# Altium schematic sheet 04_ EFR32 Signal Assign.SchDoc
size 420 x 297 mm
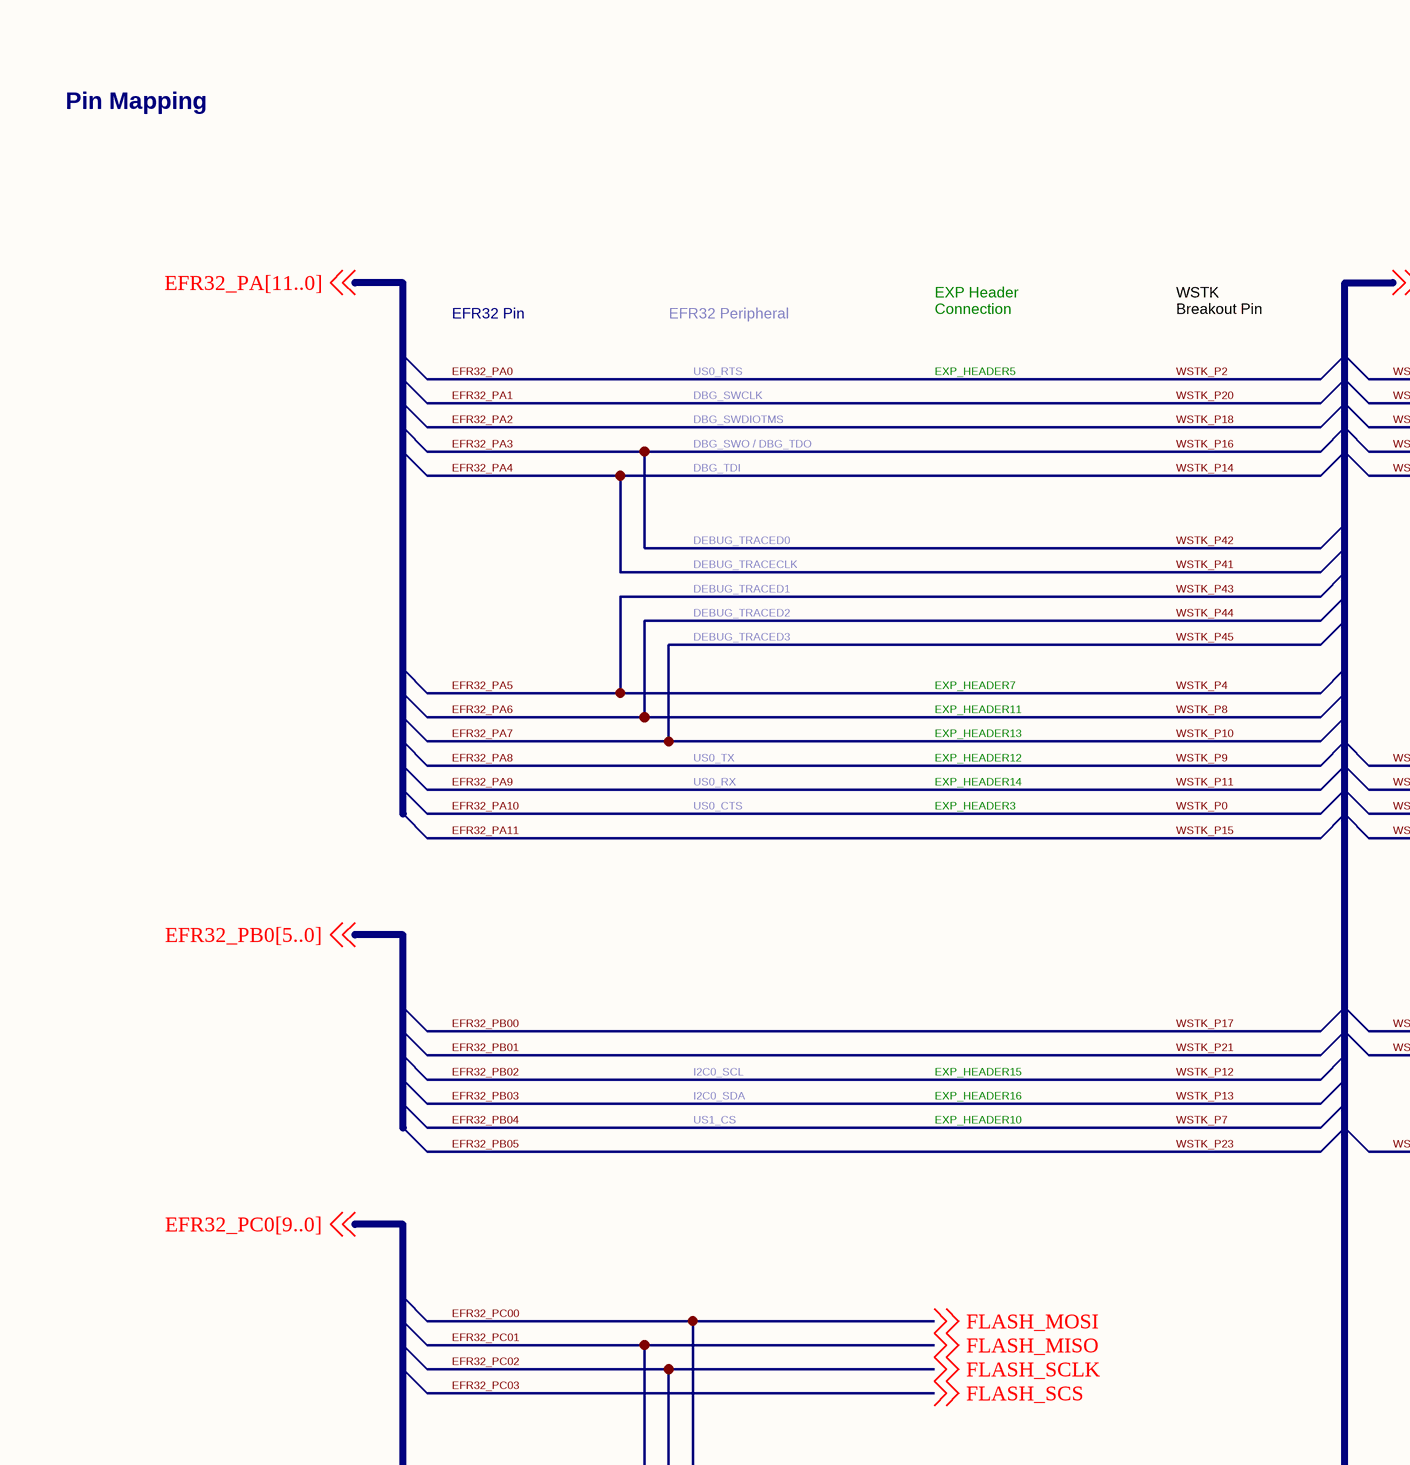
[diagram p0: 04_ EFR32 Signal Assign.SchDoc, top left]
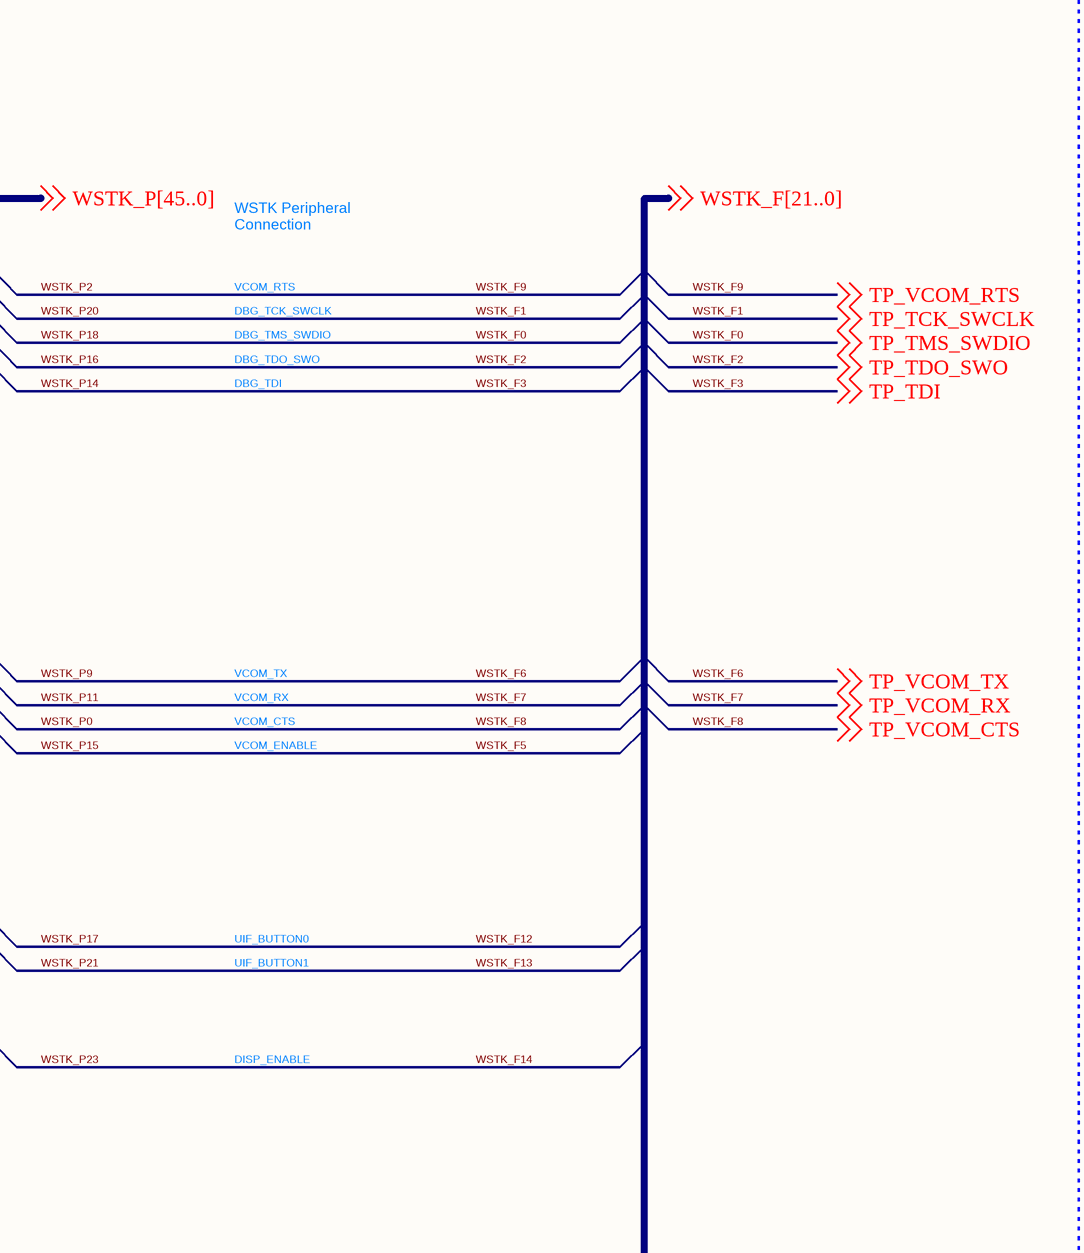
[diagram p1: 04_ EFR32 Signal Assign.SchDoc, top middle]
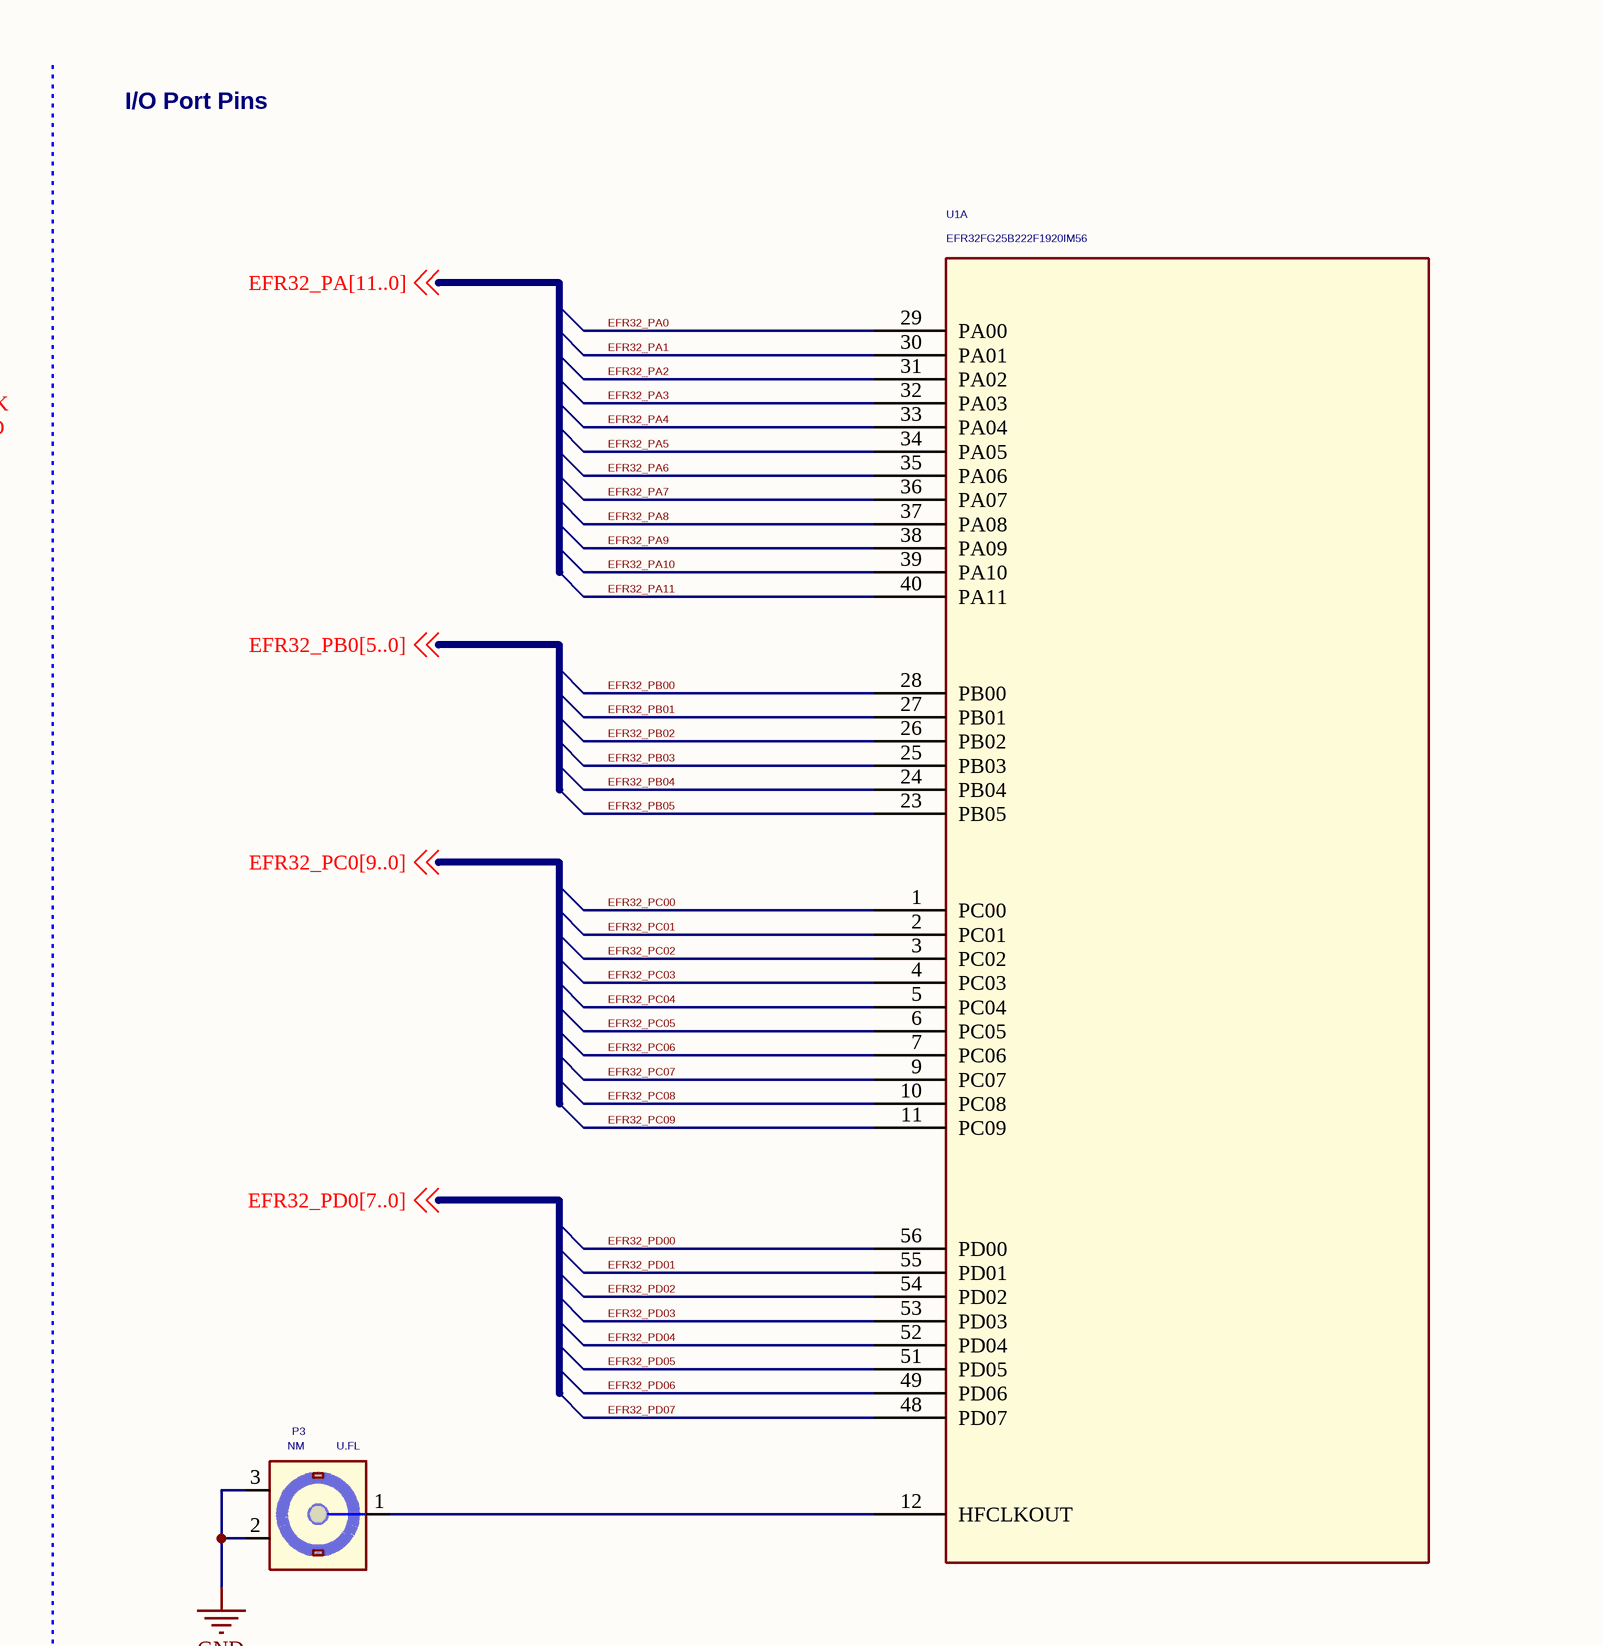
[diagram p2: 04_ EFR32 Signal Assign.SchDoc, top right]
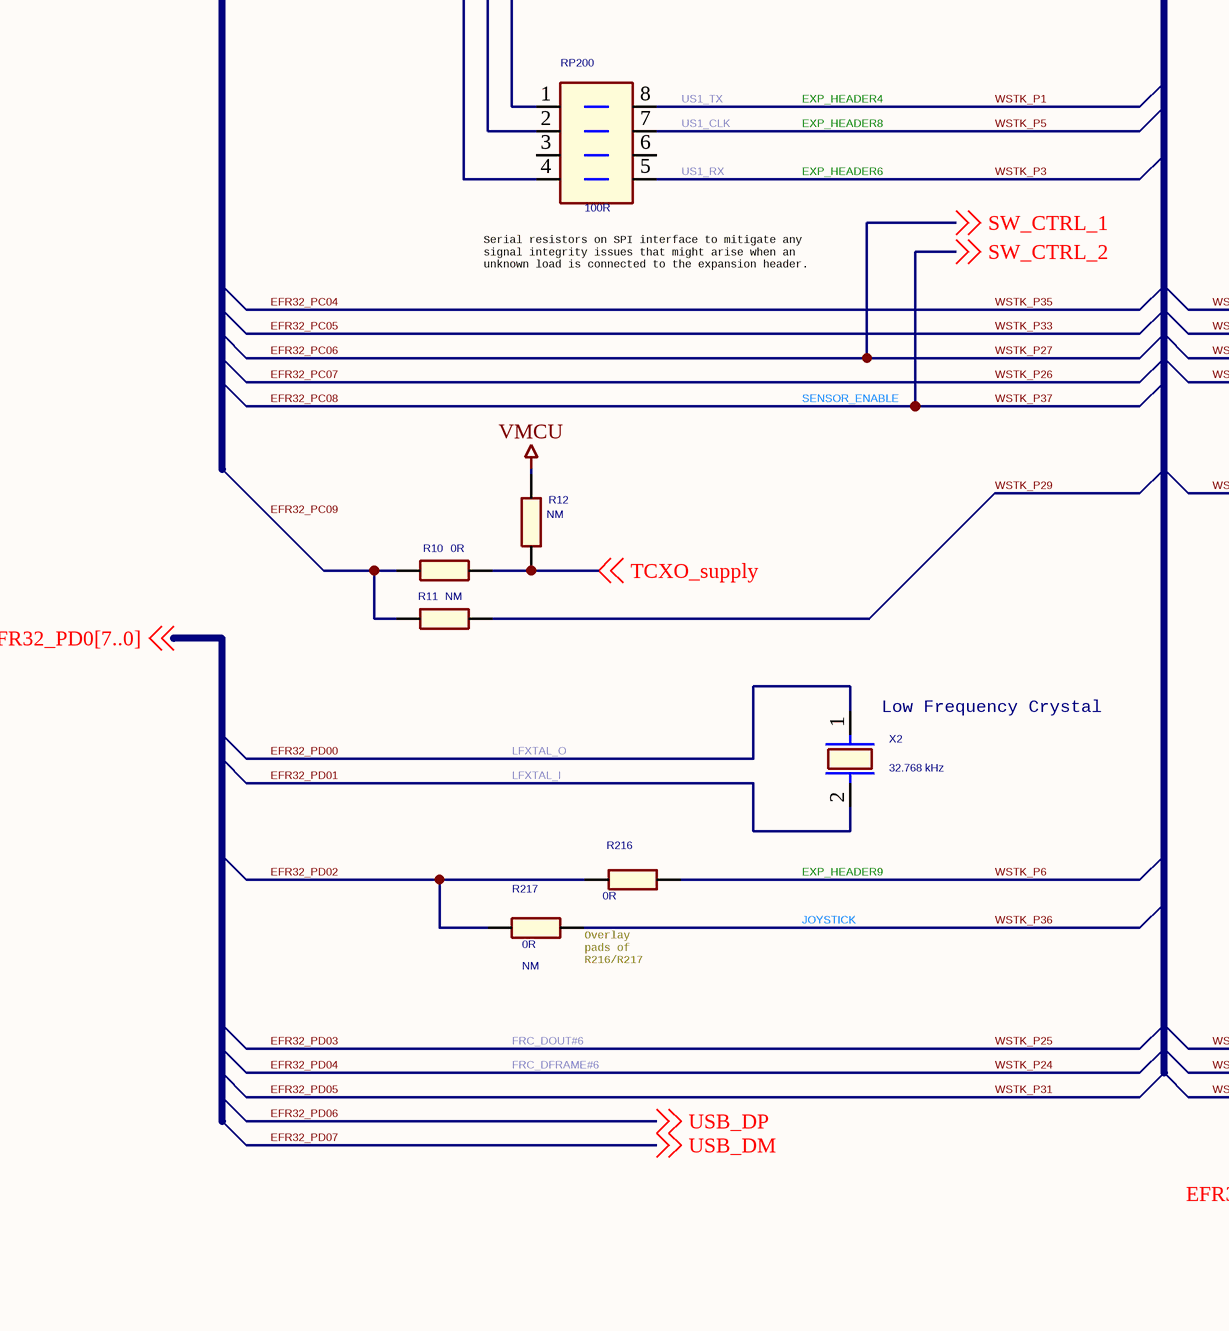
[diagram p3: 04_ EFR32 Signal Assign.SchDoc, bottom left]
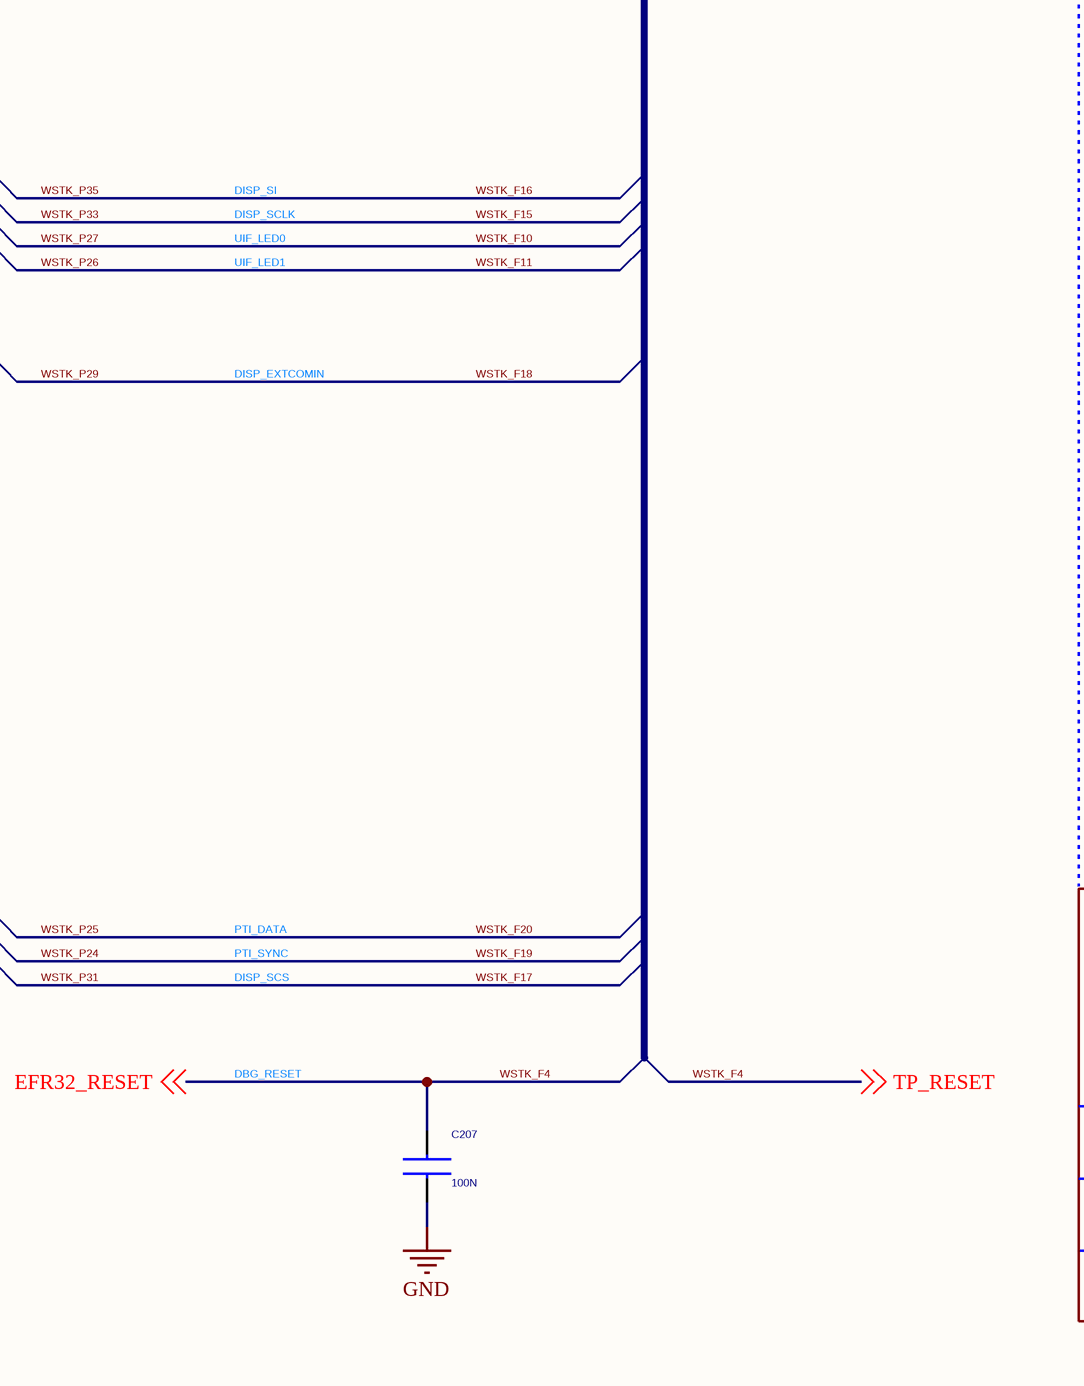
[diagram p4: 04_ EFR32 Signal Assign.SchDoc, bottom middle]
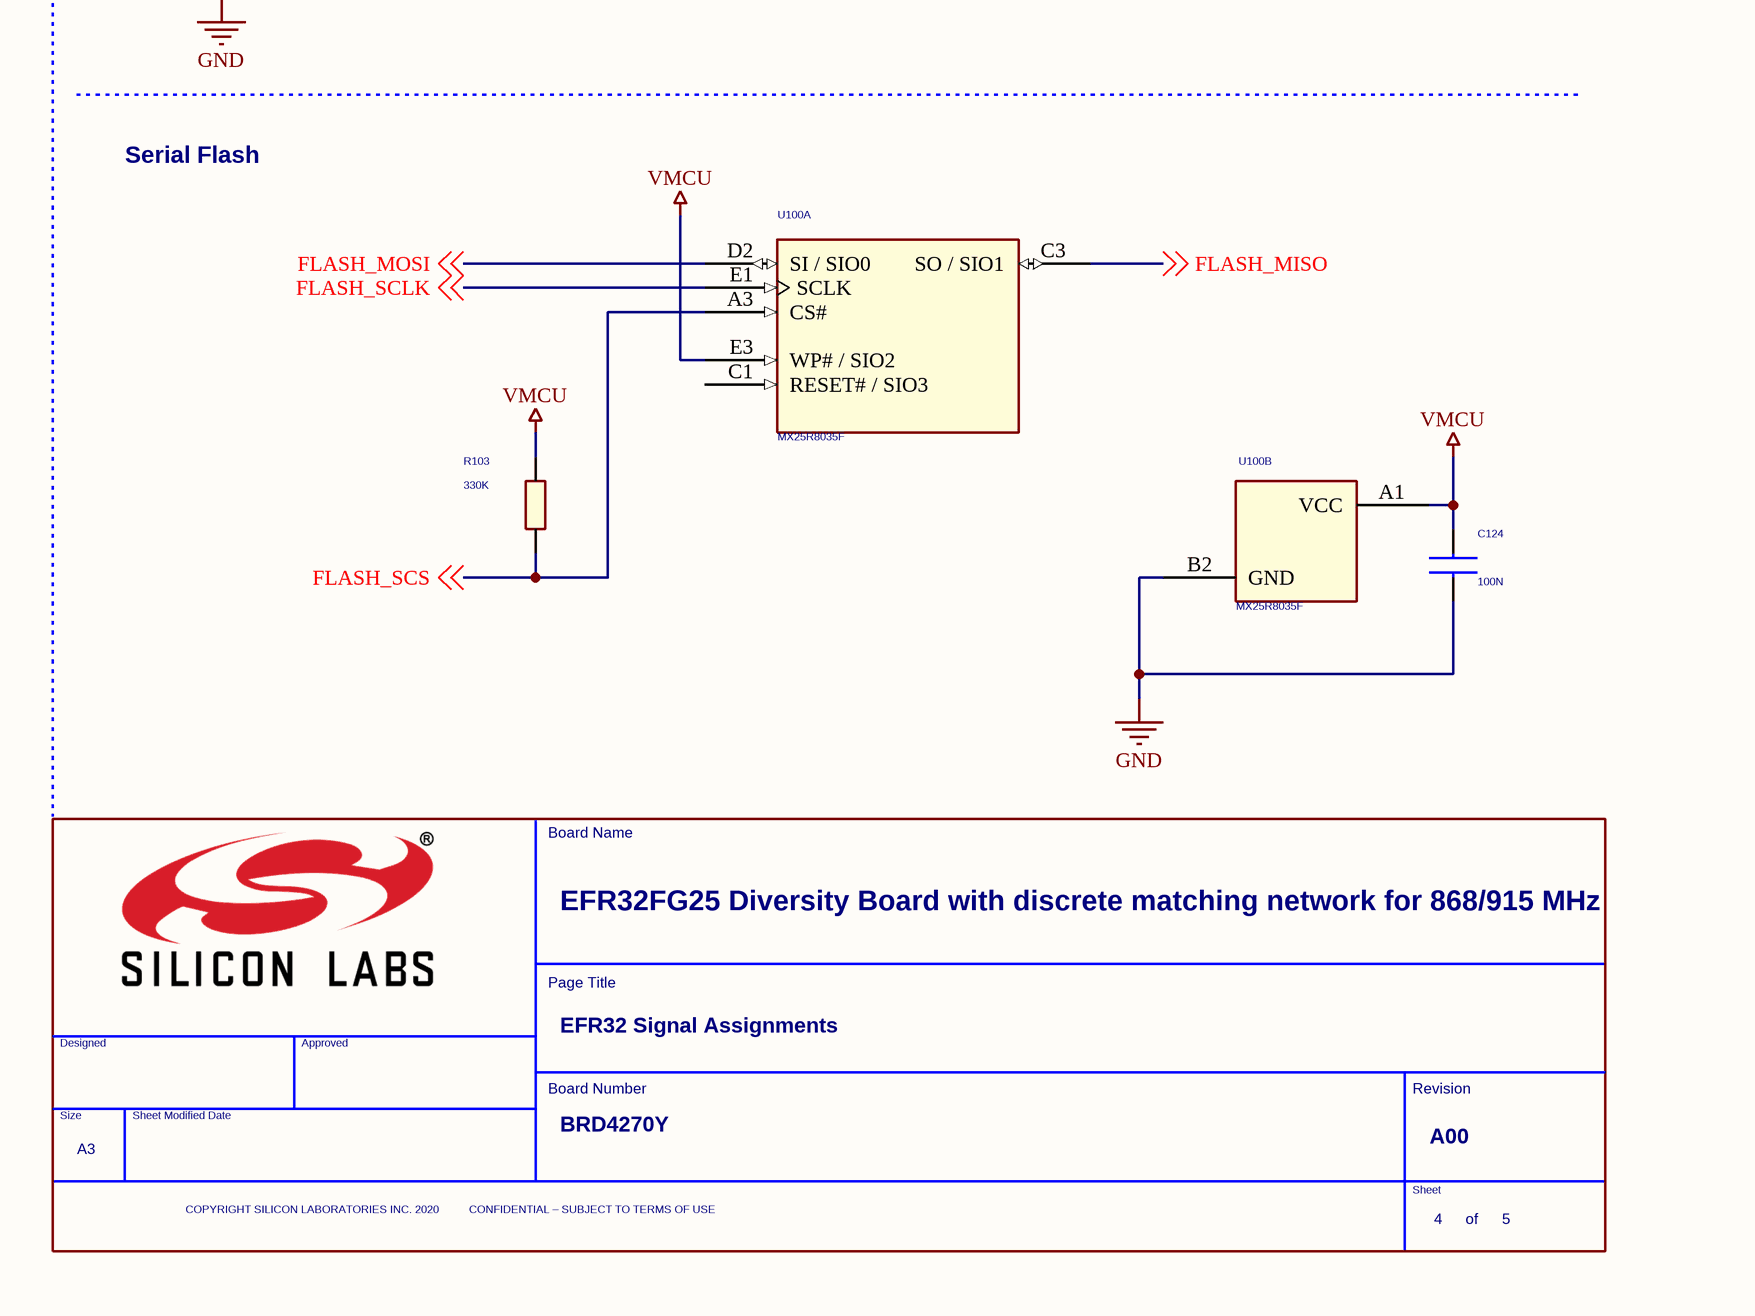
[diagram p5: 04_ EFR32 Signal Assign.SchDoc, bottom right]

## Parts
*  Title: EFR32FG25 Diversity Board with discrete matching network for 868/915 MHz  Page Count: 5  Page Number: 4  Page Size: A3  Page Title: EFR32 Signal Assignments  Board Number: BRD4270Y  RevCode: A00  (hidden comment: TitleBlock_SiliconLabs_A3)  (graphical)
C124  100N  [C0201_L]
C207  100N  [C0201_L]
P3  U.FL  Not Mounted: NM  [HIROSE_U.FL-R-SMT-1]
R10  0R  [R0402_L]
R11  NM  [R0402_L]
R12  NM  [R0402_L]
R103  330K  [R0201_L]
R216  0R  [R0402_L]
R217  0R  Not Mounted: NM  [R0402_L]
RP200  100R  [RES_MNR04-8]
U1  EFR32FG25B222F1920IM56  [QFN56_M040_7.0X7.0_EP_SL]  (part A of 3)
U100  MX25R8035F  [BGA8_M040_1.24x1.75_WLCSP]  (parts A,B of 2)
X2  32.768 kHz  [X_MCS_CM8V-T1A]

## Nets
GND: C124.2 C207.2 P3.2(GND1) P3.3(GND4) U100.B2(GND)
VMCU: C124.1 R12.2 R103.2 U100.A1(VCC) U100.E3(WP#_/_SIO2)
DBG_RESET: C207.1 ; off-sheet EFR32_RESET, off-sheet TP_RESET  [also labelled EFR32_RESET, TP_RESET, WSTK_F4]
DBG_SWCLK: U1.30(PA01) ; off-sheet TP_TCK_SWCLK  [also labelled DBG_TCK_SWCLK, EFR32_PA1, TP_TCK_SWCLK, WSTK_F1, WSTK_P20]
DBG_SWDIOTMS: U1.31(PA02) ; off-sheet TP_TMS_SWDIO  [also labelled DBG_TMS_SWDIO, EFR32_PA2, TP_TMS_SWDIO, WSTK_F0, WSTK_P18]
DBG_SWO / DBG_TDO: U1.32(PA03) ; off-sheet TP_TDO_SWO  [also labelled DBG_TDO_SWO, DEBUG_TRACED0, EFR32_PA3, TP_TDO_SWO, WSTK_F2, WSTK_P16, WSTK_P42]
DBG_TDI: U1.33(PA04) ; off-sheet TP_TDI  [also labelled DEBUG_TRACECLK, EFR32_PA4, TP_TDI, WSTK_F3, WSTK_P14, WSTK_P41]
DEBUG_TRACED1: U1.34(PA05)  [also labelled EFR32_PA5, EXP_HEADER7, WSTK_P4, WSTK_P43]
DEBUG_TRACED2: U1.35(PA06)  [also labelled EFR32_PA6, EXP_HEADER11, WSTK_P44, WSTK_P8]
DEBUG_TRACED3: U1.36(PA07)  [also labelled EFR32_PA7, EXP_HEADER13, WSTK_P10, WSTK_P45]
DISP_ENABLE: U1.23(PB05)  [also labelled EFR32_PB05, WSTK_F14, WSTK_P23]
DISP_EXTCOMIN: R11.1  [also labelled WSTK_F18, WSTK_P29]
DISP_SCLK: U1.6(PC05)  [also labelled EFR32_PC05, WSTK_F15, WSTK_P33]
DISP_SCS: U1.51(PD05)  [also labelled EFR32_PD05, WSTK_F17, WSTK_P31]
DISP_SI: U1.5(PC04)  [also labelled EFR32_PC04, WSTK_F16, WSTK_P35]
EFR32_PA0: U1.29(PA00) ; off-sheet TP_VCOM_RTS  [also labelled EXP_HEADER5, TP_VCOM_RTS, US0_RTS, VCOM_RTS, WSTK_F9, WSTK_P2]
EFR32_PA8: U1.37(PA08) ; off-sheet TP_VCOM_TX  [also labelled EXP_HEADER12, TP_VCOM_TX, US0_TX, VCOM_TX, WSTK_F6, WSTK_P9]
EFR32_PA9: U1.38(PA09) ; off-sheet TP_VCOM_RX  [also labelled EXP_HEADER14, TP_VCOM_RX, US0_RX, VCOM_RX, WSTK_F7, WSTK_P11]
EFR32_PA10: U1.39(PA10) ; off-sheet TP_VCOM_CTS  [also labelled EXP_HEADER3, TP_VCOM_CTS, US0_CTS, VCOM_CTS, WSTK_F8, WSTK_P0]
EFR32_PA11: U1.40(PA11)  [also labelled VCOM_ENABLE, WSTK_F5, WSTK_P15]
EFR32_PB00: U1.28(PB00)  [also labelled UIF_BUTTON0, WSTK_F12, WSTK_P17]
EFR32_PB01: U1.27(PB01)  [also labelled UIF_BUTTON1, WSTK_F13, WSTK_P21]
EFR32_PB02: U1.26(PB02)  [also labelled EXP_HEADER15, I2C0_SCL, WSTK_P12]
EFR32_PB03: U1.25(PB03)  [also labelled EXP_HEADER16, I2C0_SDA, WSTK_P13]
EFR32_PB04: U1.24(PB04)  [also labelled EXP_HEADER10, US1_CS, WSTK_P7]
EFR32_PC00: RP200.1(R11) U1.1(PC00) U100.D2(SI_/_SIO0) ; off-sheet FLASH_MOSI  [also labelled FLASH_MOSI]
EFR32_PC01: RP200.4(R14) U1.2(PC01) U100.C3(SO_/_SIO1) ; off-sheet FLASH_MISO  [also labelled FLASH_MISO]
EFR32_PC02: RP200.2(R12) U1.3(PC02) U100.E1(SCLK) ; off-sheet FLASH_SCLK  [also labelled FLASH_SCLK]
EFR32_PC03: R103.1 U1.4(PC03) U100.A3(CS#) ; off-sheet FLASH_SCS  [also labelled FLASH_SCS]
EFR32_PC06: U1.7(PC06) ; off-sheet SW_CTRL_1  [also labelled SW_CTRL_1, UIF_LED0, WSTK_F10, WSTK_P27]
EFR32_PC07: U1.9(PC07)  [also labelled UIF_LED1, WSTK_F11, WSTK_P26]
EFR32_PC08: U1.10(PC08) ; off-sheet SW_CTRL_2  [also labelled SENSOR_ENABLE, SW_CTRL_2, WSTK_P37]
EFR32_PC09: R10.2 R11.2 U1.11(PC09)
EFR32_PD00: U1.56(PD00) X2.1  [also labelled LFXTAL_O]
EFR32_PD01: U1.55(PD01) X2.2  [also labelled LFXTAL_I]
EFR32_PD02: R216.2 R217.1 U1.54(PD02)
EFR32_PD03: U1.53(PD03)  [also labelled FRC_DOUT#6, PTI_DATA, WSTK_F20, WSTK_P25]
EFR32_PD04: U1.52(PD04)  [also labelled FRC_DFRAME#6, PTI_SYNC, WSTK_F19, WSTK_P24]
EFR32_PD06: U1.49(PD06) ; off-sheet USB_DP  [also labelled USB_DP]
EFR32_PD07: U1.48(PD07) ; off-sheet USB_DM  [also labelled USB_DM]
EXP_HEADER4: RP200.8(R18)  [also labelled US1_TX, WSTK_P1]
EXP_HEADER6: RP200.5(R15)  [also labelled US1_RX, WSTK_P3]
EXP_HEADER8: RP200.7(R17)  [also labelled US1_CLK, WSTK_P5]
EXP_HEADER9: R216.1  [also labelled WSTK_P6]
JOYSTICK: R217.2  [also labelled WSTK_P36]
TCXO_supply: R10.1 R12.1 ; off-sheet TCXO_supply
NetP3_1: P3.1(SIGNAL) U1.12(HFCLKOUT)

Not connected (* = marked no-connect by the designer): RP200 3(R13) 6(R16); U100 C1(RESET#_/_SIO3)

## Notes on the sheet
- Pin Mapping
- I/O Port Pins
- EFR32 Pin
- EFR32 Peripheral
- EXP Header
  Connection
- WSTK
  Breakout Pin
- WSTK Peripheral
  Connection
- (near RP200) Serial resistors on SPI interface to mitigate any
  signal integrity issues that might arise when an
  unknown load is connected to the expansion header.
- Serial Flash
- (near X2) Low Frequency Crystal
- (near R217) Overlay
  pads of
  R216/R217
- (in symbol TitleBlock_SiliconLabs_A3) Board Name; Page Title; Designed; Approved; Board Number; Revision; Size; Sheet Modified Date; Sheet; COPYRIGHT SILICON LABORATORIES INC. 2020          CONFIDENTIAL – SUBJECT TO TERMS OF USE; of

## Library data of the parts
* = TitleBlock_SiliconLabs_A3: Board Approver: RGU; OrgName: Silicon Labs
C124 C207 = C0201: Rating: 16V; Tolerance: 20%; Technology: X7S
P3 = KLS_U.FL: Mfg: KLS; Mfg #: L-KLS1-IPEX-20279-001E-01; Price_1K: 0.70
R10-R12 R216 R217 = R0402: Price_1K: 0.005
R103 = R0201: Price_1K: 0.005
RP200 = MNR04M0APJ101: Mfg: ROHM; Mfg #: MNR04M0APJ101; Price_1K: 0.0122
U1 = EFR32xG25_QFN56_HFCLKOUT: MFG #: EFR32FG25B222F1920IM56-AR; MFG: Silicon Labs
U100 = MX25R8035: Mfg #: MX25R8035FBDIL0; Mfg: Macronix; Price_1K: 0.25
X2 = CM8V-T1A: Mfg #: CM8V-T1A-32.768KHZ-7PF-20PPM-TA-QC; Mfg: Micro Crystal AG; Price_1K: 0.3